# Altium schematic sheet GPS.SchDoc
size A
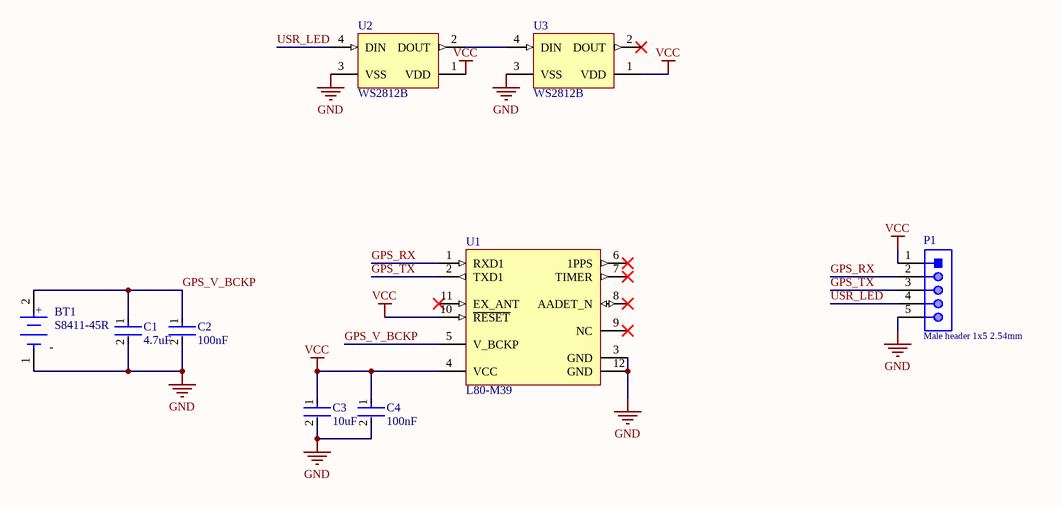
[diagram p0: GPS.SchDoc]

## Parts
BT1  S8411-45R  [FP-S8411-45R-MFG]
C1  value 4.7uF  [FP-0603-L_1_6_0_15-W_0_81-IPC_C]  (hidden comment: Generic-Capacitor)
C2  value 100nF  [FP-0603-L_1_6_0_15-W_0_81-IPC_C]  (hidden comment: Generic-Capacitor)
C3  value 10uF  [FP-0603-L_1_6_0_15-W_0_81-IPC_C]  (hidden comment: Generic-Capacitor)
C4  value 100nF  [FP-0603-L_1_6_0_15-W_0_81-IPC_C]  (hidden comment: Generic-Capacitor)
P1  Male header 1x5 2.54mm  [61300511121]
U1  L80-M39  [QUEC-L80-M39-12_V]
U2  WS2812B  [ADAI-WS2812B_V]
U3  WS2812B  [ADAI-WS2812B_V]

## Nets
GND: BT1.1(C) C1.2 C2.2 C3.2 C4.2 P1.5 U1.3(GND) U1.12(GND) U2.3(VSS) U3.3(VSS)
VCC: C3.1 C4.1 P1.1 U1.4(VCC) U1.10(~{RESET}) U2.1(VDD) U3.1(VDD)
GPS_RX: P1.2 U1.1(RXD1)
GPS_TX: P1.3 U1.2(TXD1)
GPS_V_BCKP: BT1.2(A) C1.1 C2.1 U1.5(V_BCKP)
USR_LED: P1.4 U2.4(DIN)
NetU2_2: U2.2(DOUT) U3.4(DIN)

Not connected (* = marked no-connect by the designer): U1 6(1PPS)* 7(TIMER)* 8(AADET_N)* 9(NC)* 11(EX_ANT)*; U3 2(DOUT)*

## Notes on the sheet
- (in symbol CMP-002-00079-1) +; -

## Library data of the parts
BT1 = CMP-002-00079-1: EZ-Coin Cell Battery Retainer, Horizontal SMT, for CR1220 Coin Cell Batteries
C1-C4 = CMP-001-00088-2: Generic 0603 Capacitor; Dielectric: X7R; Voltage Rating: 50V; Tolerance: 10%; ESR: 0R; Case Code (Imperial): 0603
  C1: LCSC Part #: C19666
  C2 C4: LCSC Part #: C14663
  C3: LCSC Part #: C96446
P1 = CMP-002-00081-1: THT Vertical Pin Header WR-PHD, Pitch 2.54 mm, Single Row, 5 pins
U1 = CMP-021-00008-3: GPS Module 15, 0x15, 0x4, 0mm SMD w/Antenna 3, 0V
U2 U3 = CMP-007-00035-2: Intelligent Control LED Integrated Light Source, 3.5 to 5.3 V, -25 to 80 degC, 4-Pin SMD, RoHS, Bulk; Manufacturer: Adafruit Industries; Datasheet URL: https://cdn-shop.adafruit.com/datasheets/WS2812B.pdf; Manufacturer URL: https://www.adafruit.com/; Datasheet Version: May-13; Case/Package: WS2812B; Mounting Technology: SM; RoHS Compliant: False; Package Description: 4-Pin Surface Mount Device, Body 5 x 5 mm, Pitch 3.3 mm; Package Reference: WS2812B; LCSC Part #: C4154882